# EAGLE design main (EAGLE 6.2)
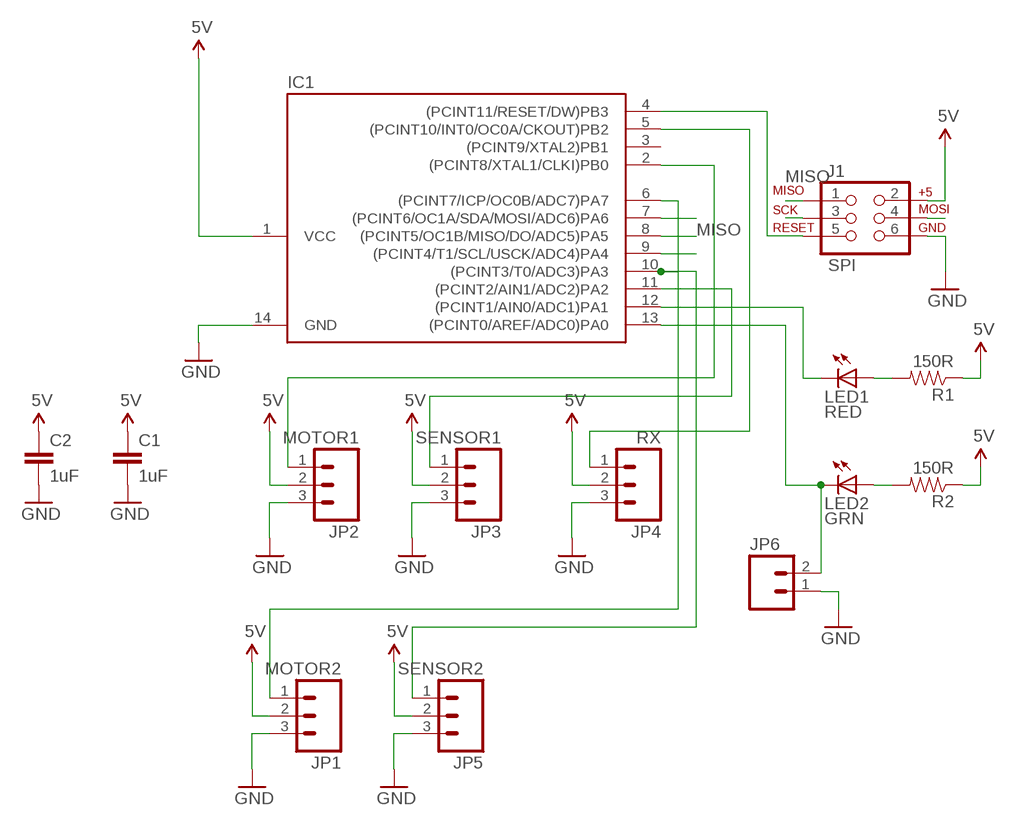
[diagram p0: schematic, sheet 1]

## Parts
C1  1uF  CAP0805  [0805]
C2  1uF  CAP0805  [0805]
IC1  ATTINY24/44/84-SSU  [SOIC14]
J1  SPI  AVR_SPI_PRG_62X3_LOCK  [2X3_LOCK]
JP1  MOTOR2  M03LOCK  [1X03_LOCK]
JP2  MOTOR1  M03LOCK  [1X03_LOCK]
JP3  SENSOR1  M03LOCK  [1X03_LOCK]
JP4  RX  M03LOCK  [1X03_LOCK]
JP5  SENSOR2  M03LOCK  [1X03_LOCK]
JP6  M02LOCK  [1X02_LOCK]
LED1  RED  LED3MM  [LED3MM]
LED2  GRN  LED3MM  [LED3MM]
R1  150R  RESISTOR0805-RES  [0805]
R2  150R  RESISTOR0805-RES  [0805]

## Nets
5V: C1.1 C2.1 IC1.1(VCC) J1.2 JP1.2 JP2.2 JP3.2 JP4.2 JP5.2 R1.1 R2.1
GND: C1.2 C2.2 IC1.14(GND) J1.6 JP1.3 JP2.3 JP3.3 JP4.3 JP5.3 JP6.1
MISO: IC1.8((PCINT5/OC1B/MISO/DO/ADC5)PA5) J1.1
MOSI: IC1.7((PCINT6/OC1A/SDA/MOSI/ADC6)PA6) J1.4
N$1: IC1.6((PCINT7/ICP/OC0B/ADC7)PA7) JP1.1
N$2: IC1.5((PCINT10/INT0/OC0A/CKOUT)PB2) JP4.1
N$3: IC1.10((PCINT3/T0/ADC3)PA3) JP5.1
N$4: IC1.2((PCINT8/XTAL1/CLKI)PB0) JP2.1
N$6: IC1.4((PCINT11/RESET/DW)PB3) J1.5
N$7: IC1.12((PCINT1/AIN0/ADC1)PA1) LED1.K(C)
N$8: LED1.A R1.2
N$9: IC1.13((PCINT0/AREF/ADC0)PA0) JP6.2 LED2.K(C)
N$10: LED2.A R2.2
N$11: IC1.11((PCINT2/AIN1/ADC2)PA2) JP3.1
SCK: IC1.9((PCINT4/T1/SCL/USCK/ADC4)PA4) J1.3
Unconnected: IC1.3((PCINT9/XTAL2)PB1)

## Library data of the parts
C1 C2 = SparkFun:CAP: Capacitor Standard 0603 ceramic capacitor, and 0.1" leaded capacitor.
IC1 = attiny24_44_84:ATTINY24/44/84
J1 = SparkFun:AVR_SPI_PRG_6: AVR ISP 6 Pin This is the reduced ISP connector for AVR programming. Common on Arduino. This footprint will take up less PCB space and can be used with a 10-pin to 6-pin adapter such as SKU: BOB-08508
JP1-JP5 = SparkFun:M03: Header 3 Standard 3-pin 0.1" header. Use with straight break away headers (SKU : PRT-00116), right angle break away headers (PRT-00553), swiss pins (PRT-00743), machine pins (PRT-00117), and female headers (PRT-00115). Molex polarized connector foot print use with SKU : PRT-08232 with associated crimp pins and housings.
JP6 = SparkFun:M02: Header 2 Standard 2-pin 0.1" header. Use with straight break away headers (SKU : PRT-00116), right angle break away headers (PRT-00553), swiss pins (PRT-00743), machine pins (PRT-00117), and female headers (PRT-00115). Molex polarized connector foot print use with SKU : PRT-08233 with associated crimp pins and housings.
LED1 LED2 = SparkFun:LED: LEDs Standard schematic elements and footprints for 5mm, 3mm, 1206, and 0603 sized LEDs. 5mm - Spark Fun Electronics SKU : COM-00529 (and others)
R1 R2 = SparkFun:RESISTOR: Resistor Basic schematic elements and footprints for 0603, 1206, and PTH resistors.

## Board
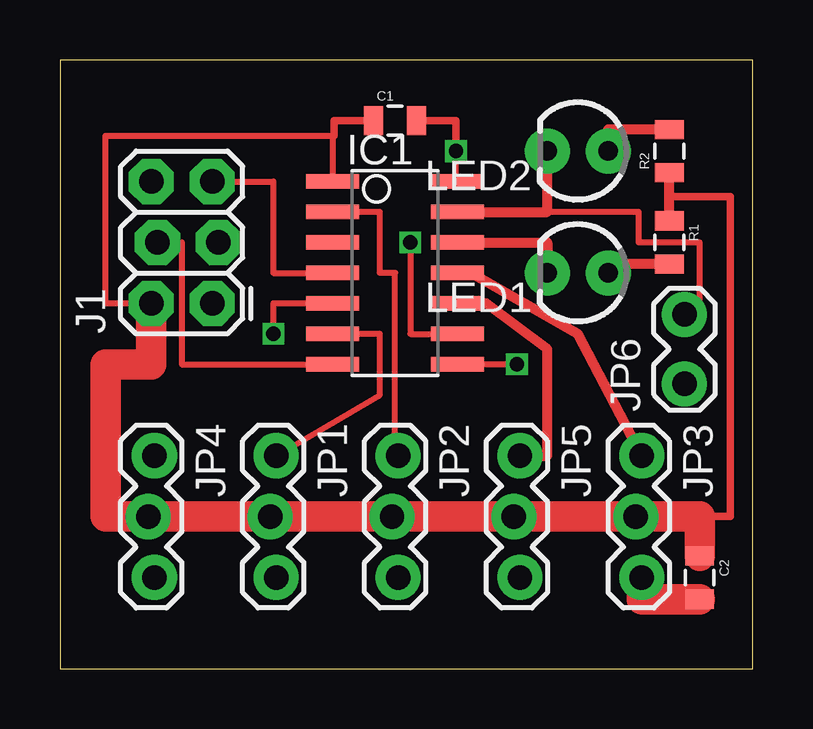
[diagram p1: board, top side]
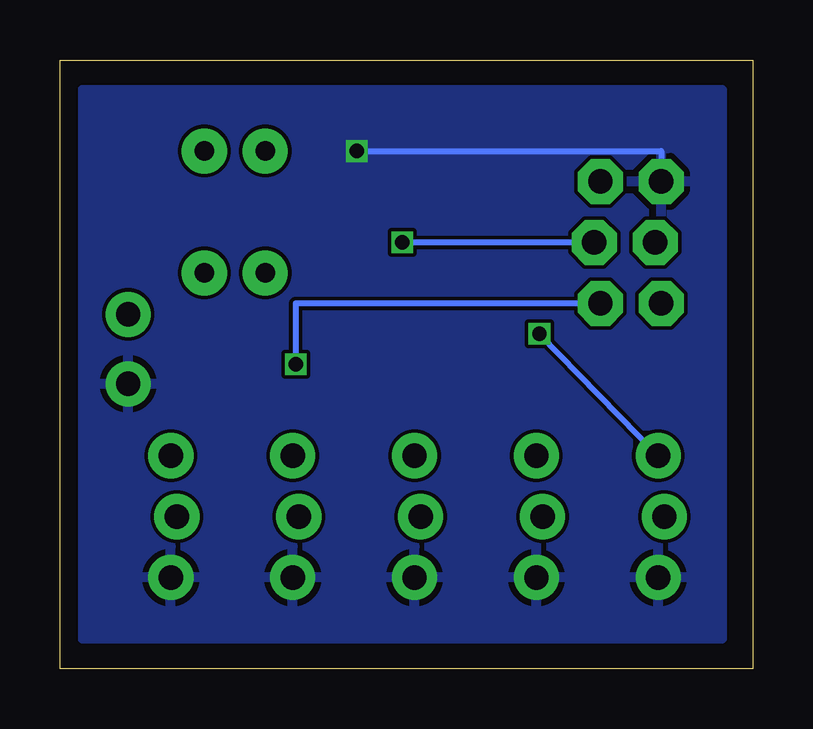
[diagram p2: board, bottom side, seen from below]

Size 28.88 x 25.39 mm. Coordinates in mm from the lower left corner, seen from the top.
Outline: 0,0 28.88,0 28.88,25.39 0,25.39 0,0
Copper layers (1*16): Top 0.035mm / dielectric 1.5mm / Bottom 0.035mm
Design rules: minimum track width 6mil, minimum drill 12mil, track to track 6mil, track to pad 6mil, pad to pad 6mil, via to via 6mil, smd to smd 0mil, copper to edge 10mil, drill to drill 10mil, minimum pad ring 10mil, minimum via ring 6mil, stop-mask expansion 2mil, vias tented up to drill 100mil, thermal gap 10mil

### Footprints (pad centres in the part's own frame; a part is rotated, then mirrored left to right if it is on the bottom)
0805 = smd 0.8 x 1.2: 1 -0.9,0; 2 0.9,0
SOIC14 = smd 0.61 x 2.21: 1 -3.81,-2.603; 2 -2.54,-2.603; 3 -1.27,-2.603; 4 0,-2.603; 5 1.27,-2.603; 6 2.54,-2.603; 7 3.81,-2.603; 8 3.81,2.603; 9 2.54,2.603; 10 1.27,2.603; 11 0,2.603; 12 -1.27,2.603; 13 -2.54,2.603; 14 -3.81,2.603
2X3_LOCK = drill 1.016 pad 1.88 octagon: 1 0,0; 2 0,2.54; 3 2.54,-0.254; 4 2.54,2.286; 5 5.08,0; 6 5.08,2.54
1X03_LOCK = drill 1.016 pad 1.88: 1 0,0.127; 2 2.54,-0.127; 3 5.08,0.127
1X02_LOCK = drill 1.016 pad 1.88: 1 -0.178,0; 2 2.718,0
LED3MM = drill 0.813 pad 1.88: A -1.27,0; K 1.27,0

### Placement (x,y rotation side)
C1  13.97,22.86 0 top
C2  26.67,3.81 270 top
IC1  13.97,16.51 270 top
J1  6.35,15.24 90 top
JP1  8.89,8.89 270 top
JP2  13.97,8.89 270 top
JP3  24.13,8.89 270 top
JP4  3.81,8.89 270 top
JP5  19.05,8.89 270 top
JP6  26.04,12.06 90 top
LED1  21.59,16.51 180 top
LED2  21.59,21.59 180 top
R1  25.4,17.78 270 top
R2  25.4,21.59 90 top

### Tracks (layer width: path | path; a pad name or v marks a point on that pad's centre or on a via)
5V
  Top 0.254: J1.2 1.9,15.24 1.9,22.22 11.37,22.22 | 11.43,22.22 11.37,22.22 | 11.37,22.22 IC1.1
  Top 0.305: 25.4,19.69 27.94,19.69 27.94,6.35 26.67,6.35 | 11.43,22.22 11.43,22.86 C1.1
  Top 0.406: R1.1 25.4,19.69 R2.1
  Top 1.27: J1.2 3.81,12.7 1.9,12.7 1.9,6.35 JP4.2 JP1.2 JP2.2 JP5.2 JP3.2 26.67,6.35 C2.1
GND  (via drill 0.6)
  Top 0.254: IC1.14 16.51,20.32 v16.51,21.59
  Top 0.305: C1.2 16.51,22.86 v16.51,21.59
  Top 1.27: C2.2 24.26,2.91 JP3.3
  Bottom 0.254: v16.51,21.59 3.81,21.59 J1.6
  pour Bottom: 1.27,1.27 1.27,24.13 27.94,24.13 27.94,1.27
MISO  (via drill 0.6)
  Top 0.254: v19.05,12.7 IC1.8
  Bottom 0.254: J1.1 19.05,15.24 v19.05,12.7
MOSI
  Top 0.254: J1.4 5.08,17.78 5.08,12.7 IC1.7
N$1
  Top 0.254: JP1.1 13.34,11.43 13.34,13.97 IC1.6
N$2  (via drill 0.6)
  Top 0.254: IC1.5 8.89,15.24 v8.89,13.97
  Bottom 0.254: v8.89,13.97 JP4.1
N$3
  Top 0.406: JP5.1 20.32,8.89 20.32,13.34 17.78,15.24 IC1.10
N$4
  Top 0.254: JP2.1 13.97,8.89 13.97,16.51 13.34,16.51 13.34,19.05 IC1.2
N$6
  Top 0.254: J1.5 8.89,20.32 8.89,16.51 IC1.4
N$7
  Top 0.406: IC1.12 20.32,17.78 LED1.K
N$8
  Top 0.406: R1.2 22.86,16.88 LED1.A
N$9
  Top 0.254: JP6.2 26.67,14.78 26.67,17.78 24.13,17.78 24.13,19.05 20.32,19.05
  Top 0.406: IC1.13 20.32,19.05 LED2.K
N$10
  Top 0.406: R2.2 22.86,22.49 LED2.A
N$11
  Top 0.406: JP3.1 21.59,13.97 17.14,16.51 IC1.11
SCK  (via drill 0.6)
  Top 0.254: v14.61,17.78 14.61,13.97 IC1.9
  Bottom 0.254: J1.3 v14.61,17.78